# EAGLE design I2C LCD Backpack (EAGLE 7.5.0)
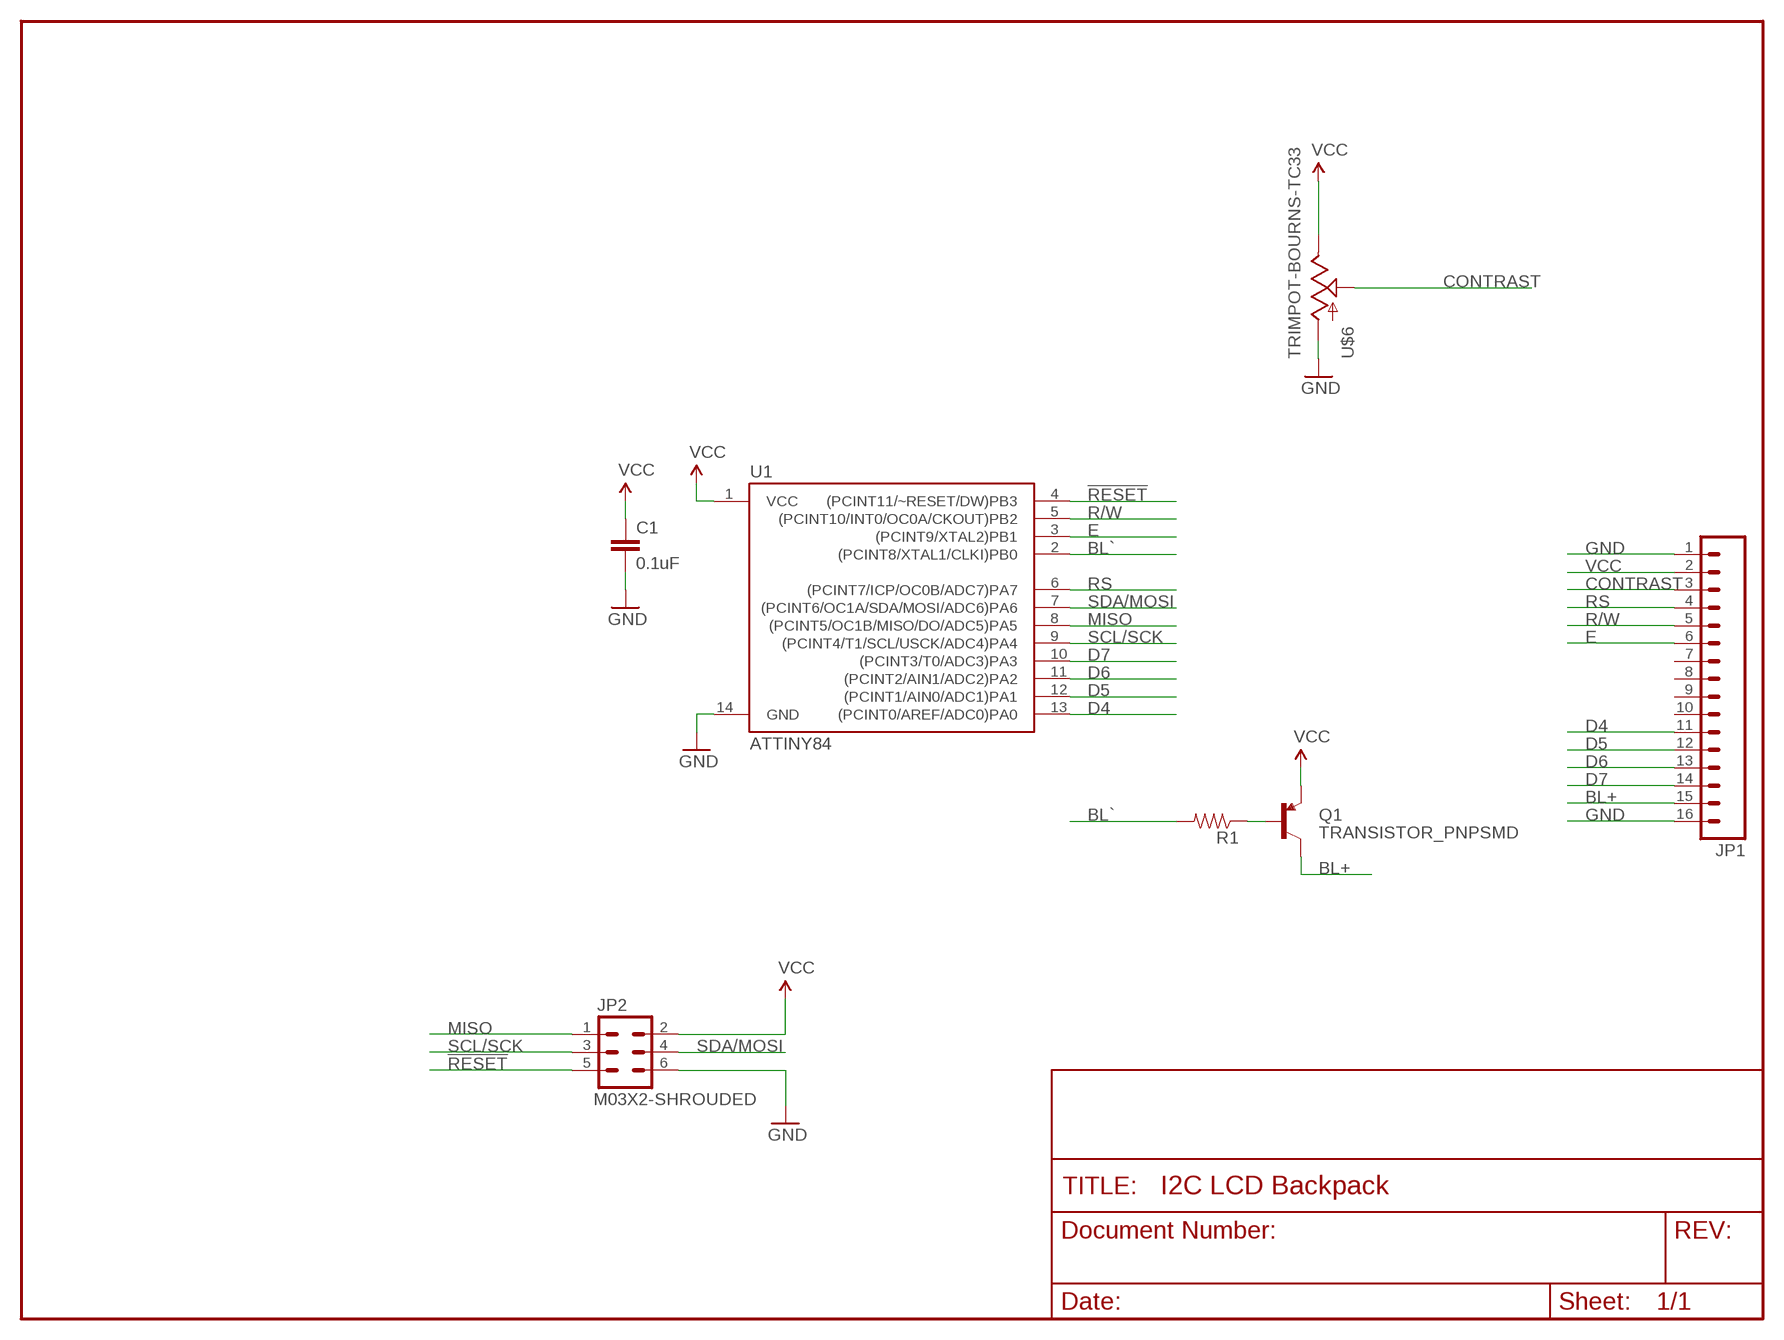
[diagram p0: schematic, sheet 1]

## Parts
C1  0.1uF  0.1UF-25V(+80/-20%)(0603)  [0603-CAP]
JP1  M16PTH  [1X16]
JP2  M03X2-SHROUDED  [2X3-SHROUDED-B]
Q1  TRANSISTOR_PNPSMD  [SOT23-3]
R1  RESISTOR0603-RES  [0603-RES]
U1  ATTINY84  [SO14]
U$6  TRIMPOT-BOURNS-TC33  [TRIMPOT-BOURNS-TC33]

## Nets
!RESET: JP2.5 U1.4((PCINT11/~RESET/DW)PB3)
BL+: JP1.15 Q1.3(C)
BL`: R1.2 U1.2((PCINT8/XTAL1/CLKI)PB0)
CONTRAST: JP1.3 U$6.2(S)
D4: JP1.11 U1.13((PCINT0/AREF/ADC0)PA0)
D5: JP1.12 U1.12((PCINT1/AIN0/ADC1)PA1)
D6: JP1.13 U1.11((PCINT2/AIN1/ADC2)PA2)
D7: JP1.14 U1.10((PCINT3/T0/ADC3)PA3)
E: JP1.6 U1.3((PCINT9/XTAL2)PB1)
GND: C1.2 JP1.1 JP1.16 JP2.6 U1.14(GND) U$6.1(A)
MISO: JP2.1 U1.8((PCINT5/OC1B/MISO/DO/ADC5)PA5)
N$13: Q1.1(B) R1.1
R/W: JP1.5 U1.5((PCINT10/INT0/OC0A/CKOUT)PB2)
RS: JP1.4 U1.6((PCINT7/ICP/OC0B/ADC7)PA7)
SCL/SCK: JP2.3 U1.9((PCINT4/T1/SCL/USCK/ADC4)PA4)
SDA/MOSI: JP2.4 U1.7((PCINT6/OC1A/SDA/MOSI/ADC6)PA6)
VCC: C1.1 JP1.2 JP2.2 Q1.2(E) U1.1(VCC) U$6.3(E)
Unconnected: JP1.7 JP1.8 JP1.9 JP1.10

## Library data of the parts
C1 = SparkFun-Capacitors:0.1UF-25V(+80/-20%)(0603): CAP-00810 Ceramic Standard decoupling cap; PROD_ID: CAP-00810
JP1 = SparkFun-Connectors:M16: 1x16 .1" header
JP2 = Darryl:M03X2
Q1 = SparkFun:TRANSISTOR_PNP
R1 = SparkFun-Resistors:RESISTOR: Resistor Basic schematic elements and footprints for 0603, 1206, and PTH resistors.
U1 = SparkFun-DigitalIC:ATTINY84: Atmel 14-pin 2/4/8kB flash uC; PROD_ID: IC-11285
U$6 = Darryl-Electromechanical:TRIMPOT

## Board
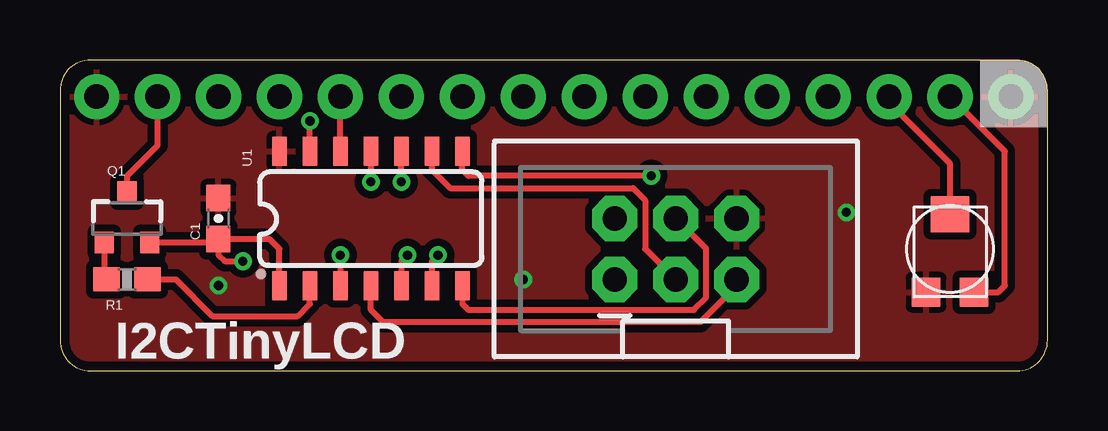
[diagram p1: board, top side]
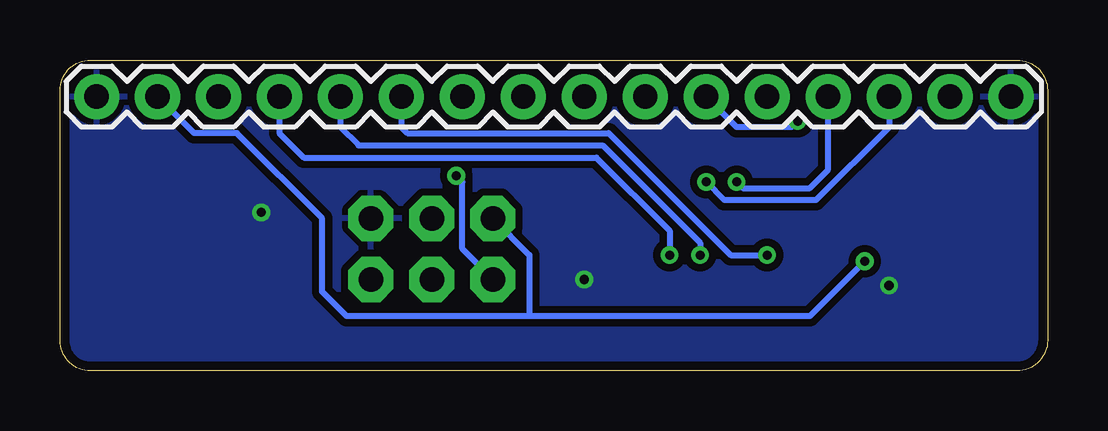
[diagram p2: board, bottom side, seen from below]

Size 41.15 x 12.95 mm. Coordinates in mm from the lower left corner, seen from the top.
Outline: 0,11.68 0,1.27 arc90 1.27,0 39.88,0 arc90 41.15,1.27 41.15,11.68 arc90 39.88,12.95 1.27,12.95 arc90 0,11.68
Copper layers (1*16): Top 0.0356mm / dielectric 1.5011mm / Bottom 0.0356mm
Design rules "oshpark-2layer *": minimum track width 6mil, minimum drill 13mil, track to track 6mil, track to pad 6mil, pad to pad 6mil, via to via 6mil, smd to smd 6mil, copper to edge 15mil, drill to drill 6mil, minimum pad ring 7mil, minimum via ring 7mil, stop-mask expansion 4mil, vias tented up to drill 20mil, thermal gap 10mil

### Footprints (pad centres in the part's own frame; a part is rotated, then mirrored left to right if it is on the bottom)
0603-CAP = smd 1.1 x 1: 1 -0.85,0; 2 0.85,0
1X16 = drill 1.016 pad 1.88: 1 0,0; 2 2.54,0; 3 5.08,0; 4 7.62,0; 5 10.16,0; 6 12.7,0; 7 15.24,0; 8 17.78,0; 9 20.32,0; 10 22.86,0; 11 25.4,0; 12 27.94,0; 13 30.48,0; 14 33.02,0; 15 35.56,0; 16 38.1,0
2X3-SHROUDED-B = drill 1.016 pad 1.88 octagon: 1 -2.54,-1.27; 2 -2.54,1.27; 3 0,-1.27; 4 0,1.27; 5 2.54,-1.27; 6 2.54,1.27
SOT23-3 = smd 0.8 x 0.9: 1 -0.95,-1; 2 0.95,-1; 3 0,1.1
0603-RES = smd 1.1 x 1: 1 -0.85,0; 2 0.85,0
SO14 = smd 0.6 x 1.2: 1 -3.81,-2.8; 2 -2.54,-2.8; 3 -1.27,-2.8; 4 0,-2.8; 5 1.27,-2.8; 6 2.54,-2.8; 7 3.81,-2.8; 8 3.81,2.8; 9 2.54,2.8; 10 1.27,2.8; 11 0,2.8; 12 -1.27,2.8; 13 -2.54,2.8; 14 -3.81,2.8
TRIMPOT-BOURNS-TC33 = smd 1.2 x 1.2: 1 -1,-1.8; 3 1,-1.8 | smd 1.6 x 1.5: 2 0,1.45

### Placement (x,y rotation side)
C1  6.6,6.35 90 top
JP1  39.62,11.43 0 bottom
JP2  25.65,5.08 0 top
Q1  2.79,6.35 0 top
R1  2.79,3.81 0 top
U1  12.95,6.35 0 top
U$6  37.08,5.08 0 top

### Tracks (layer width: path | path; a pad name or v marks a point on that pad's centre or on a via)
!RESET
  Top 0.254: JP2.5 28.19,3.56 26.67,2.03 13.46,2.03 12.95,2.54 U1.4
BL+
  Top 0.254: Q1.3 2.79,8.13 4.06,9.4 JP1.15
BL`
  Top 0.254: R1.2 4.83,3.81 6.35,2.29 9.91,2.29 10.41,2.79 U1.2
CONTRAST
  Top 0.254: U$6.2 37.08,8.64 34.54,11.18 JP1.3
D4  (via drill 0.38)
  Top 0.254: U1.13 v10.41,10.41
  Bottom 0.254: v10.41,10.41 10.67,10.16 12.95,10.16 JP1.11
D5
  Top 0.254: U1.12 JP1.12
D6  (via drill 0.38)
  Top 0.254: U1.11 v12.95,7.87
  Bottom 0.254: v12.95,7.87 12.7,7.62 9.91,7.62 9.14,8.38 JP1.13
D7  (via drill 0.38)
  Top 0.254: v14.22,7.87 U1.10
  Bottom 0.254: JP1.14 6.6,10.16 9.65,7.11 13.46,7.11 v14.22,7.87
E  (via drill 0.38)
  Top 0.254: v11.68,4.83 U1.3
  Bottom 0.254: JP1.6 26.92,10.16 26.67,9.91 18.29,9.91 13.21,4.83 v11.68,4.83
GND  (via drill 0.38)
  other vias: 6.6,3.56 19.3,3.81 32.77,6.6
  pour Bottom (isolate 0.305): 0,11.68 0,1.27 arc90 1.27,0 39.88,0 arc90 41.15,1.27 41.15,11.68 arc90 39.88,12.95 1.27,12.95 arc90
  pour Top (isolate 0.305): 0,11.68 0,1.27 arc90 1.27,0 39.88,0 arc90 41.15,1.27 41.15,11.68 arc90 39.88,12.95 1.27,12.95 arc90
MISO  (via drill 0.38)
  Top 0.254: v24.64,8.13 17.02,8.13 16.76,8.38 U1.8
  Bottom 0.254: JP2.1 24.38,5.08 24.38,7.87 v24.64,8.13
N$13
  Top 0.254: Q1.1 1.84,3.91 R1.1
R/W  (via drill 0.38)
  Top 0.254: v14.48,4.83 14.22,4.57 U1.5
  Bottom 0.254: JP1.5 29.46,10.16 28.7,9.4 18.54,9.4 14.48,5.33 v14.48,4.83
RS  (via drill 0.38)
  Top 0.254: v15.75,4.83 15.49,4.57 U1.6
  Bottom 0.254: JP1.4 32,9.91 30.99,8.89 18.8,8.89 15.75,5.84 v15.75,4.83
SCL/SCK
  Top 0.254: U1.9 15.49,8.38 16.26,7.62 23.88,7.62 24.38,7.11 24.38,5.08 JP2.3
SDA/MOSI
  Top 0.254: U1.7 16.76,2.79 17.02,2.54 26.42,2.54 26.92,3.05 26.92,5.08 JP2.4
VCC  (via drill 0.38)
  Top 0.254: Q1.2 6.45,5.35 C1.1 | U1.1 9.14,5.08 8.72,5.5 C1.1 | U$6.3 39.09,3.28 39.37,3.56 39.37,9.14 JP1.2 | C1.1 6.6,4.83 6.86,4.57 v7.62,4.57
  Bottom 0.254: JP2.2 21.59,4.83 21.59,2.29 | 21.59,2.29 29.21,2.29 30.23,3.3 30.23,6.35 33.78,9.91 35.56,9.91 JP1.2 | v7.62,4.57 9.91,2.29 21.59,2.29

### Text on the board
tPlace: I2CTinyLCD